# EAGLE schematic openx3 (EAGLE 9.5.2)
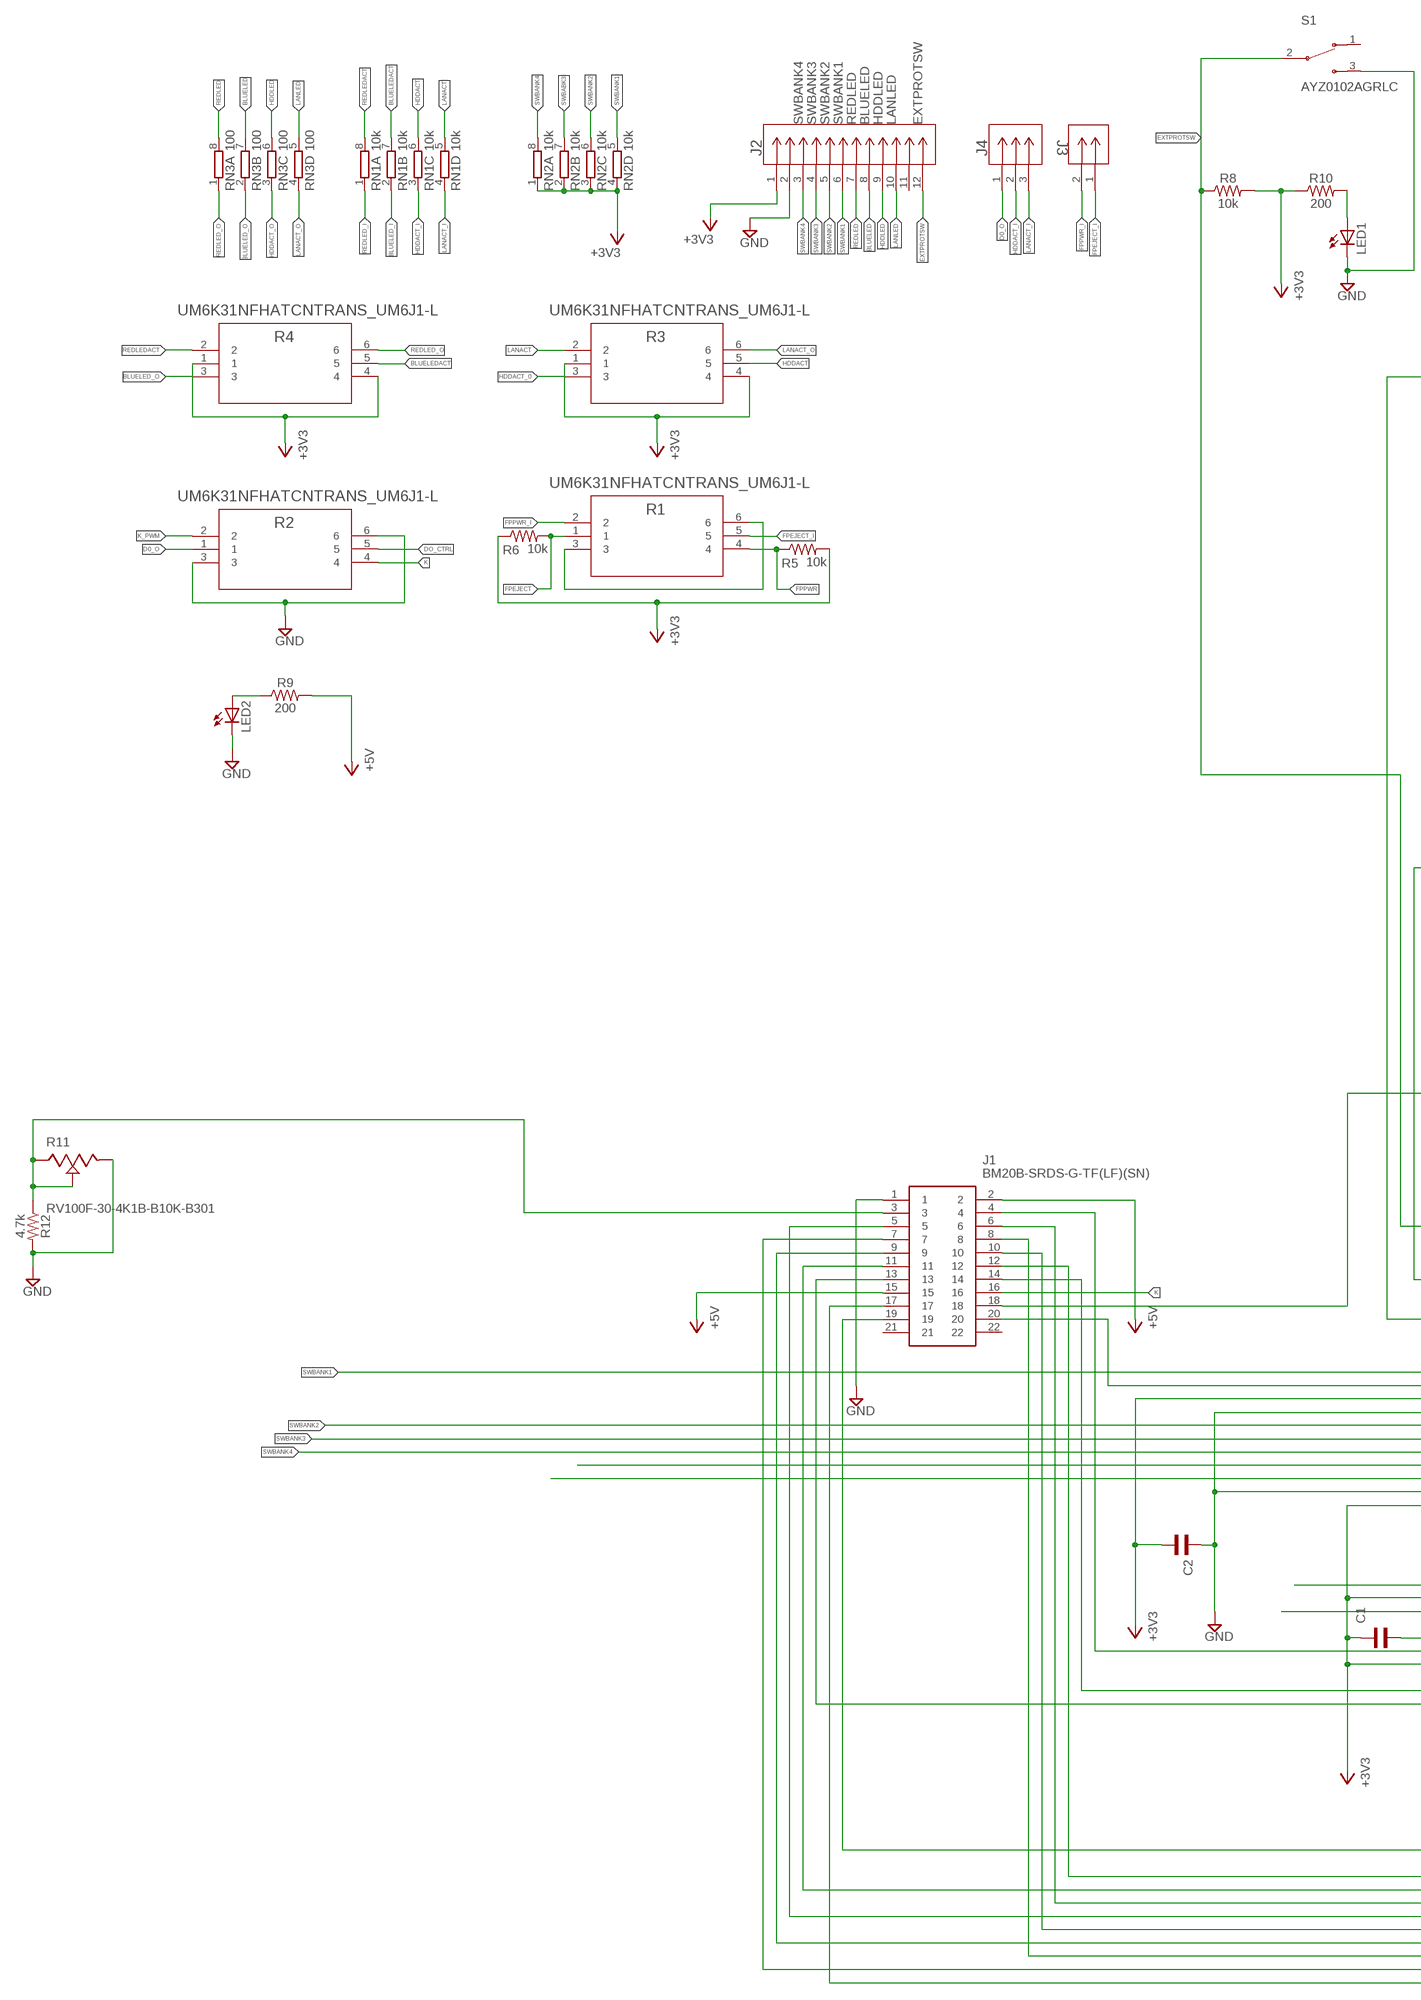
[diagram p0: schematic, sheet 1, part 1 of 2]
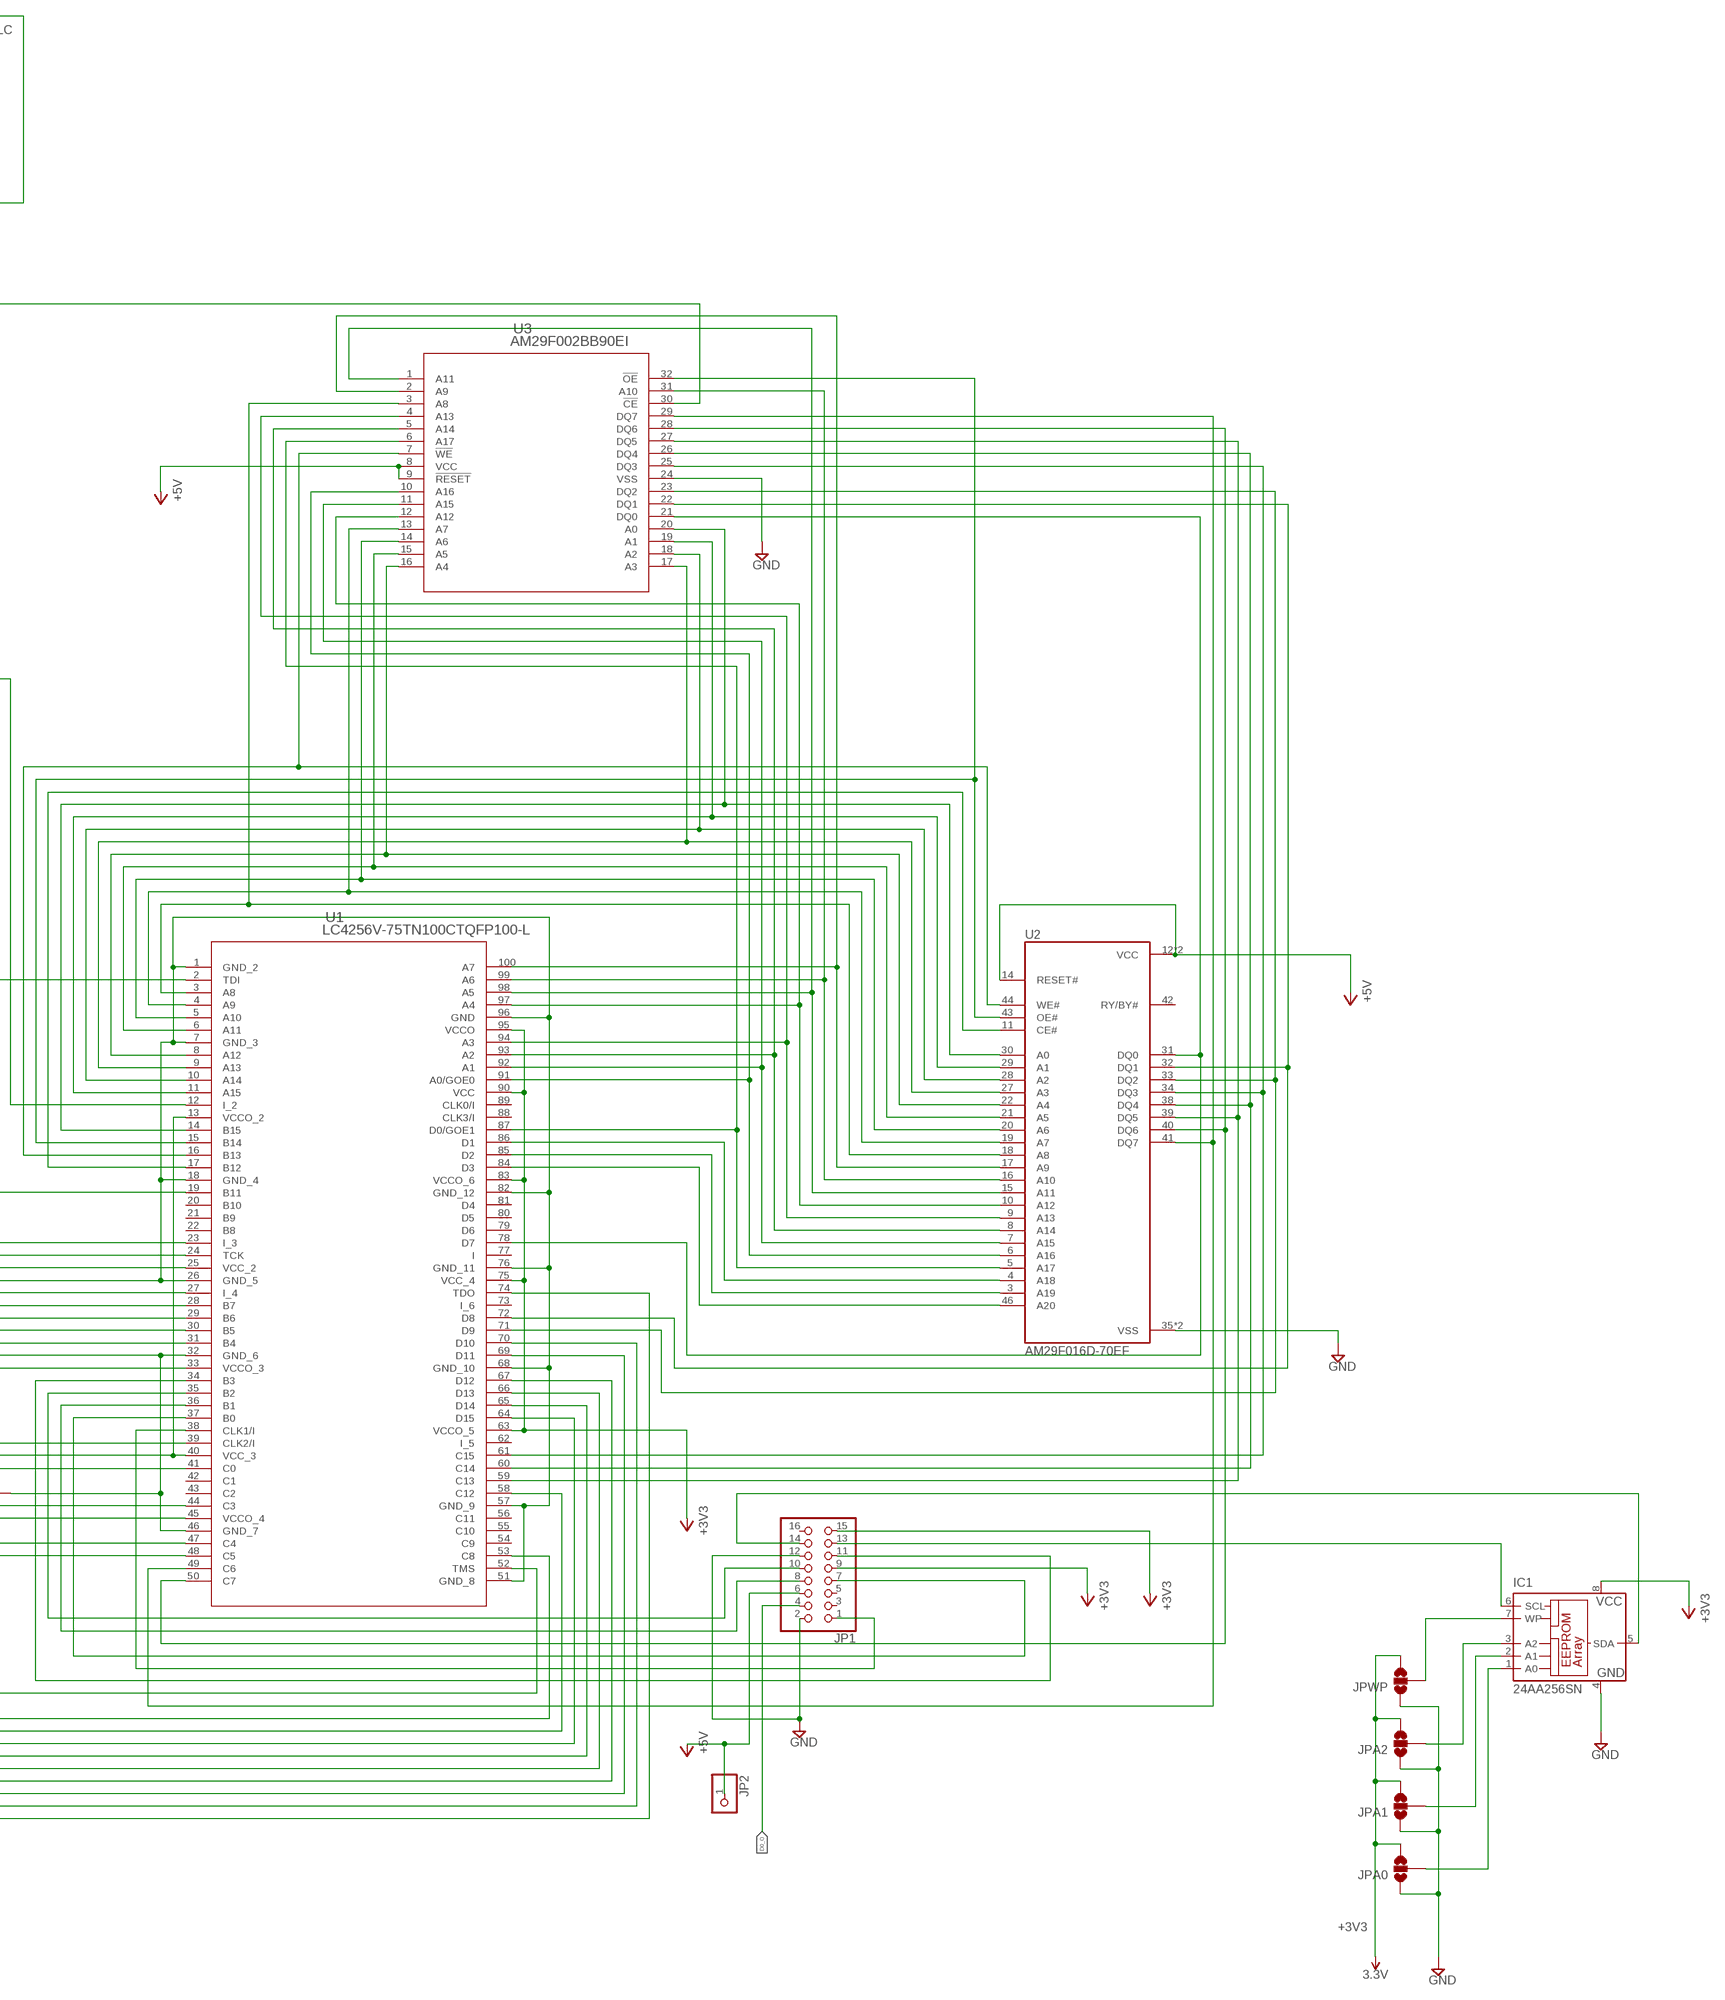
[diagram p1: schematic, sheet 1, part 2 of 2]

## Parts
C1  WCAP-CSGP_0603_885012006001_REFLOW  [WCAP-CSGP_0603_REFLOW]
C2  WCAP-CSGP_0603_885012006001_REFLOW  [WCAP-CSGP_0603_REFLOW]
IC1  24AA256SN  [SO-08]
J1  BM20B-SRDS-G-TF(LF)(SN)  [BM20BSRDSGTFLFSN]
J2  SM12B-SRSS-TB(LF)(SN)  [CONN_SM12B-SRSS-TB(LF)(SN)]
J3  53398-0271  [CON00327_2]
J4  1734260-3  [CON3_1X3_DRM125_HPI]
JP1  PINHD-2X8  [2X08]
JP2  PINHD-1X1  [1X01]
JPA0  JUMPER-SMT_3_NO_NO-SILK  [SMT-JUMPER_3_NO_NO-SILK]
JPA1  JUMPER-SMT_3_NO_NO-SILK  [SMT-JUMPER_3_NO_NO-SILK]
JPA2  JUMPER-SMT_3_NO_NO-SILK  [SMT-JUMPER_3_NO_NO-SILK]
JPWP  JUMPER-SMT_3_NO_NO-SILK  [SMT-JUMPER_3_NO_NO-SILK]
LED1  LEDCHIPLED_0805  [CHIPLED_0805]
LED2  LEDCHIPLED_0805  [CHIPLED_0805]
R1  UM6K31NFHATCNTRANS_UM6J1-L  [TRANS_UM6J1-L]
R2  UM6K31NFHATCNTRANS_UM6J1-L  [TRANS_UM6J1-L]
R3  UM6K31NFHATCNTRANS_UM6J1-L  [TRANS_UM6J1-L]
R4  UM6K31NFHATCNTRANS_UM6J1-L  [TRANS_UM6J1-L]
R5  10k  10KOHM-0603-1/10W-1%  [0603]
R6  10k  10KOHM-0603-1/10W-1%  [0603]
R8  10k  10KOHM-0603-1/10W-1%  [0603]
R9  200  200OHM-0603-1/10W-1%  [0603]
R10  200  200OHM-0603-1/10W-1%  [0603]
R11  RV100F-30-4K1B-B10K-B301  [TRIM_RV100F-30-4K1B-B10K-B301]
R12  4.7k  4.7KOHM-0603-1/10W-1%  [0603]
RN1  10k  4R-N0603-ARV  [0603-ARV]
RN2  10k  4R-N0603-ARV  [0603-ARV]
RN3  100  4R-N0603-ARV  [0603-ARV]
S1  AYZ0102AGRLC  [SW_AYZ0102AGRLC]
U1  LC4256V-75TN100CTQFP100-L  [TQFP100-L]
U2  AM29F016D-70EF  [SOP50P2000X120-48N]
U3  AM29F002BB90EI  [TS032]

## Nets
+3V3: C1.2 C2.1 IC1.8(VCC) J2.1 JP1.9 JP1.15 JPA0.3 JPA1.3 JPA2.3 JPWP.3 R3.1 R3.4 R4.1 R4.4 R5.2 R6.1 R8.2 R10.1 RN2.1 RN2.2 RN2.3 RN2.4 U1.13(VCCO_2) U1.25(VCC_2) U1.33(VCCO_3) U1.40(VCC_3) U1.45(VCCO_4) U1.63(VCCO_5) U1.75(VCC_4) U1.83(VCCO_6) U1.90(VCC) U1.95(VCCO) ; supply symbol labelled 3.3V
+5V: J1.2 J1.15 JP1.6 JP2.1 R9.2 U2.12(VCC) U2.14(RESET#) U2.37(VCC) U3.8(VCC) U3.9(!RESET)
A0: U1.14(B15) U2.30(A0) U3.20(A0)
A1: U1.11(A15) U2.29(A1) U3.19(A1)
A2: U1.10(A14) U2.28(A2) U3.18(A2)
A3: U1.9(A13) U2.27(A3) U3.17(A3)
A4: U1.8(A12) U2.22(A4) U3.16(A4)
A5: U1.6(A11) U2.21(A5) U3.15(A5)
A6: U1.5(A10) U2.20(A6) U3.14(A6)
A7: U1.4(A9) U2.19(A7) U3.13(A7)
A8: U1.3(A8) U2.18(A8) U3.3(A8)
A9: U1.100(A7) U2.17(A9) U3.2(A9)
A10: U1.99(A6) U2.16(A10) U3.31(A10)
A11: U1.98(A5) U2.15(A11) U3.1(A11)
A12: U1.97(A4) U2.10(A12) U3.12(A12)
A13: U1.94(A3) U2.9(A13) U3.4(A13)
A14: U1.93(A2) U2.8(A14) U3.5(A14)
A15: U1.92(A1) U2.7(A15) U3.11(A15)
A16: U1.91(A0/GOE0) U2.6(A16) U3.10(A16)
A17: U1.87(D0/GOE1) U2.5(A17) U3.6(A17)
A18: U1.86(D1) U2.4(A18)
A19: U1.85(D2) U2.3(A19)
A20: U1.84(D3) U2.46(A20)
BLUELED: J2.8 RN3.7
BLUELED_I: RN1.2
BLUELED_O: R4.3 RN3.2
BLUELEDACT: R4.5 RN1.7
BUFLCE#: U1.19(B11) U3.30(!CE)
D0_O: J4.1 JP1.4 R2.1
DB0: J1.7 U1.70(D10)
DB1: J1.8 U1.69(D11)
DB2: J1.9 U1.67(D12)
DB3: J1.10 U1.66(D13)
DB4: J1.11 U1.58(C12)
DB5: J1.12 U1.53(C8)
DB6: J1.13 U1.48(C5)
DB7: J1.14 U1.47(C4)
DO_CTRL: R2.5
DQ0: U1.78(D7) U2.31(DQ0) U3.21(DQ0)
DQ1: U1.72(D8) U2.32(DQ1) U3.22(DQ1)
DQ2: U1.71(D9) U2.33(DQ2) U3.23(DQ2)
DQ3: U1.61(C15) U2.34(DQ3) U3.25(DQ3)
DQ4: U1.60(C14) U2.38(DQ4) U3.26(DQ4)
DQ5: U1.59(C13) U2.39(DQ5) U3.27(DQ5)
DQ6: U1.50(C7) U2.40(DQ6) U3.28(DQ6)
DQ7: U1.49(C6) U2.41(DQ7) U3.29(DQ7)
E: J1.6 U1.64(D15)
EPA0: IC1.1(A0) JPA0.2
EPA1: IC1.2(A1) JPA1.2
EPA2: IC1.3(A2) JPA2.2
EPWP: IC1.7(WP) JPWP.2
EXTPROTSW: J2.12 R8.1 S1.2 U1.12(I_2)
FPEJECT: R1.1 R6.2
FPEJECT_I: J3.1 R1.5
FPPWR: R1.4 R5.1
FPPWR_I: J3.2 R1.2
GND: C1.1 C2.2 IC1.4(GND) J1.1 J2.2 JP1.2 JP1.12 JPA0.1 JPA1.1 JPA2.1 JPWP.1 LED1.C LED2.C R2.3 R2.6 R11.3 R12.2 S1.3 U1.1(GND_2) U1.7(GND_3) U1.18(GND_4) U1.26(GND_5) U1.32(GND_6) U1.46(GND_7) U1.51(GND_8) U1.57(GND_9) U1.68(GND_10) U1.76(GND_11) U1.82(GND_12) U1.96(GND) U2.35(VSS) U2.36(VSS) U3.24(VSS)
HDDACT: R3.5 RN1.6
HDDACT_0: R3.3
HDDACT_I: J4.2 RN1.3
HDDACT_O: RN3.3
HDDLED: J2.9 RN3.6
K: J1.16 R2.4
K_PWM: R2.2
LAD0: JP1.11 U1.34(B3)
LAD1: JP1.10 U1.35(B2)
LAD2: JP1.8 U1.36(B1)
LAD3: JP1.7 U1.37(B0)
LANACT: R3.2 RN1.5
LANACT_I: J4.3 RN1.4
LANACT_O: R3.6 RN3.4
LANLED: J2.10 RN3.5
LCLK: JP1.1 U1.38(CLK1/I)
MNFLCE#: U1.17(B12) U2.11(CE#)
N$1: LED2.A R9.1
N$5: LED1.A R10.2
N$56: R1.3 R1.6
N$59: U1.39(CLK2/I)
N$61: U1.41(C0)
N$78: U1.31(B4)
N$79: U1.30(B5)
OE#: U1.15(B14) U2.43(OE#) U3.32(!OE)
REDLED: J2.7 RN3.8
REDLED_I: RN1.1
REDLED_O: R4.6 RN3.1
REDLEDACT: R4.2 RN1.8
RS: J1.4 U1.44(C3)
RW: J1.5 U1.65(D14)
SCL: IC1.6(SCL) JP1.13
SDA: IC1.5(SDA) JP1.14
SWBABK3: RN2.7
SWBANK1: J2.6 RN2.5 U1.23(I_3)
SWBANK2: J2.5 RN2.6 U1.27(I_4)
SWBANK3: J2.4 U1.28(B7)
SWBANK4: J2.3 RN2.8 U1.29(B6)
TCK: J1.20 U1.24(TCK)
TDI: J1.18 U1.2(TDI)
TDO: J1.17 U1.74(TDO)
TMS: J1.19 U1.52(TMS)
VO: J1.3 R11.1 R11.2 R12.1
WE#: U1.16(B13) U2.44(WE#) U3.7(!WE)
Unconnected: J1.21 J1.22 J2.11 JP1.3 JP1.5 JP1.16 S1.1 U1.20(B10) U1.21(B9) U1.22(B8) U1.42(C1) U1.43(C2) U1.54(C9) U1.55(C10) U1.56(C11) U1.62(I_5) U1.73(I_6) U1.77(I) U1.79(D6) U1.80(D5) U1.81(D4) U1.88(CLK3/I) U1.89(CLK0/I) U2.42(RY/BY#)

## Library data of the parts
C1 C2 = Wurth_Elektronik_Passive_Capacitors_rev18b:WCAP-CSGP_0603: WCAP-CSGP Ceramic Capacitors Characteristics Multilayer Ceramic Chip Capacitor Recommended soldering:Reflow, for 0603 and 0805 wave soldering is also allowed Operating temperature:-55 °C to +125 °C; Ceramic characteristics: Class I - NPO ; Class II -X7R, X5R High performance ceramic High capacitance stability Minimal aging Termination:Cu/Ni/Sn <http://katalog.we-online.de/media/images/eisos/WCAP-CSGP_pf2.jpg> Details see: http://katalog.we-online.de/en/pbs/WCAP-CSGP-0603? Created: 2015-01-28 2015 (C) Wurth Elektronik
IC1 = microchip:24*: Serial EEPROM I2C; MPN: 24AA256T-I/SM; OC_FARNELL: 1579570; OC_NEWARK: 08N6838
J1 = BM20B-SRDS-G-TFLFSN:BM20B-SRDS-G-TF(LF)(SN): JST SHD, 1mm Pitch, 20 Way, Vertical PCB Header, Surface Mount Source: Datasheet <http://www.jst-mfg.com/product/pdf/eng/eSHD.pdf>; DESCRIPTION: JST SHD, 1mm Pitch, 20 Way, Right Angle PCB Header, Surface Mount; HEIGHT: 5.5mm; MANUFACTURER_NAME: JST (JAPAN SOLDERLESS TERMINALS); MANUFACTURER_PART_NUMBER: BM20B-SRDS-G-TF(LF)(SN)
J2 = SM12B-SRSS-TB:SM12B-SRSS-TB(LF)(SN); BUILT_BY: EMA_Cory; COPYRIGHT: Copyright (C) 2018 Accelerated Designs. All rights reserved; MANUFACTURER_PART_NUMBER: SM12B-SRSS-TB(LF)(SN); VENDOR: JST
J3 = Molex 2 pos 53398-0271:53398-0271; BUILT_BY: EMA_Don; COPYRIGHT: Copyright (C) 2016 Accelerated Designs. All rights reserved; MANUFACTURER_PART_NUMBER: 53398-0271; VENDOR: Molex Connector Corporation
J4 = TE 3 pos 1734260-3:1734260-3; BUILT_BY: EMA_UL_Team; MANUFACTURER_PART_NUMBER: 1734260-3; VENDOR: TE Connectivity
JP1 = pinhead:PINHD-2X8: PIN HEADER
JP2 = pinhead:PINHD-1X1: PIN HEADER
JPA0 JPA1 JPA2 JPWP = SparkFun-Jumpers:JUMPER-SMT_3_NO: Normally open jumper This jumper has three pads in close proximity to each other. Apply solder to close the connection(s).
LED1 LED2 = adafruit:LED: LED OSRAM: - CHIPLED LG R971, LG N971, LY N971, LG Q971, LY Q971, LO R971, LY R971 LH N974, LH R974 LS Q976, LO Q976, LY Q976 LO Q996 - Hyper CHIPLED LW Q18S LB Q993, LB Q99A, LB R99A - SideLED LS A670, LO A670, LY A670, LG A670, LP A670 LB A673, LV A673, LT A673, LW A673 LH A674 LY A675 LS A676, LA A676, LO A676, LY A676, LW A676 LS A679, LY A679, LG A679 - Hyper Micro SIDELED® LS Y876, LA Y876, LO Y876, LY Y876 LT Y87S - SmartLED LW L88C, LW L88S LB L89C, LB L89S, LG L890 LS L89K, LO L89K, LY L89K LS L896, LA L896, LO L896, LY L896 - TOPLED LS T670, LO T670, LY T670, LG T670, LP T670 LSG T670, LSP T670, LSY T670, LOP T670, LYG T670 LG T671, LOG T671, LSG T671 LB T673, LV T673, LT T673, LW T673 LH T674 LS T676, LA T676, LO T676, LY T676, LB T676, LH T676, LSB T676, LW T676 LB T67C, LV T67C, LT T67C, LS T67K, LO T67K, LY T67K, LW E67C LS E67B, LA E67B, LO E67B, LY E67B, LB E67C, LV E67C, LT E67C LW T67C LS T679, LY T679, LG T679 LS T770, LO T770, LY T770, LG T770, LP T770 LB T773, LV T773, LT T773, LW T773 LH T774 LS E675, LA E675, LY E675, LS T675 LS T776, LA T776, LO T776, LY T776, LB T776 LHGB T686 LT T68C, LB T68C - Hyper Mini TOPLED® LB M676 - Mini TOPLED Santana® LG M470 LS M47K, LO M47K, LY M47K Source: http://www.osram.convergy.de/
R1-R4 = UM6K31NFHA:UM6K31NFHATCN; BUILT_BY: EMA_Matt; COPYRIGHT: Copyright (C) 2018 Accelerated Designs. All rights reserved; MANUFACTURER_PART_NUMBER: UM6K31NFHATCN; VENDOR: ROHM Semiconductor
R5 R6 R8 = SparkFun-Resistors:10KOHM: 10kΩ resistor A resistor is a passive two-terminal electrical component that implements electrical resistance as a circuit element. Resistors act to reduce current flow, and, at the same time, act to lower voltage levels within circuits. - Wikipedia; PROD_ID: RES-00824
R9 R10 = SparkFun-Resistors:200OHM: 200Ω resistor A resistor is a passive two-terminal electrical component that implements electrical resistance as a circuit element. Resistors act to reduce current flow, and, at the same time, act to lower voltage levels within circuits. - Wikipedia; PROD_ID: RES-08220
R11 = RV100F-30-4K1B-B10K-B301:RV100F-30-4K1B-B10K-B301: Thumbwheel Potentiometers 10mm Linear 10K PC Mount; AVAILABILITY: Unavailable; DESCRIPTION: Thumbwheel Potentiometers 10mm Linear 10K PC Mount; MF: Alpha Taiwan; MP: RV100F-30-4K1B-B10K-B301; PACKAGE: None; PRICE: None
R12 = SparkFun-Resistors:4.7KOHM: 4.7kΩ resistor A resistor is a passive two-terminal electrical component that implements electrical resistance as a circuit element. Resistors act to reduce current flow, and, at the same time, act to lower voltage levels within circuits. - Wikipedia; PROD_ID: RES-07857
RN1-RN3 = resistor-dil:4R-N: Array Chip Resistor Source: RS Component / Phycomp; OC_FARNELL: unknown; OC_NEWARK: unknown
S1 = AYZ0102AGRLC:AYZ0102AGRLC: Switch Slide ON ON SPDT Side Slide 0.1A 12VDC 1.2VA 10000Cycles Gull Wing SMD T/R; AVAILABILITY: Unavailable; DESCRIPTION: Slide Switch SPDT Surface Mount, Right Angle; MF: C&K; MP: AYZ0102AGRLC; PACKAGE: None; PRICE: None
U1 = LC4256V-75VTN100C:LC4256V-75TN100C; BUILT_BY: EMA_UL_Team; MANUFACTURER_PART_NUMBER: LC4256V-75TN100C; VENDOR: Lattice
U2 = AM29F016D-70EF:AM29F016D-70EF: NOR Flash Parallel 5V 16M-bit 2M x 8 70ns 48-Pin TSOP; AVAILABILITY: Unavailable; DESCRIPTION: NOR Flash Parallel 5V 16M-bit 2M x 8 70ns 48-Pin TSOP; MF: Spansion; MP: AM29F016D-70EF; PACKAGE: TSOP-48 Spansion; PRICE: None
U3 = AM29F002BB-90EI:AM29F002BB90EI; BUILT_BY: EMA_UL_Team; MANUFACTURER_PART_NUMBER: AM29F002BB90EI; VENDOR: Spansion